# EAGLE design stm8l101_core (EAGLE 7.3.0)
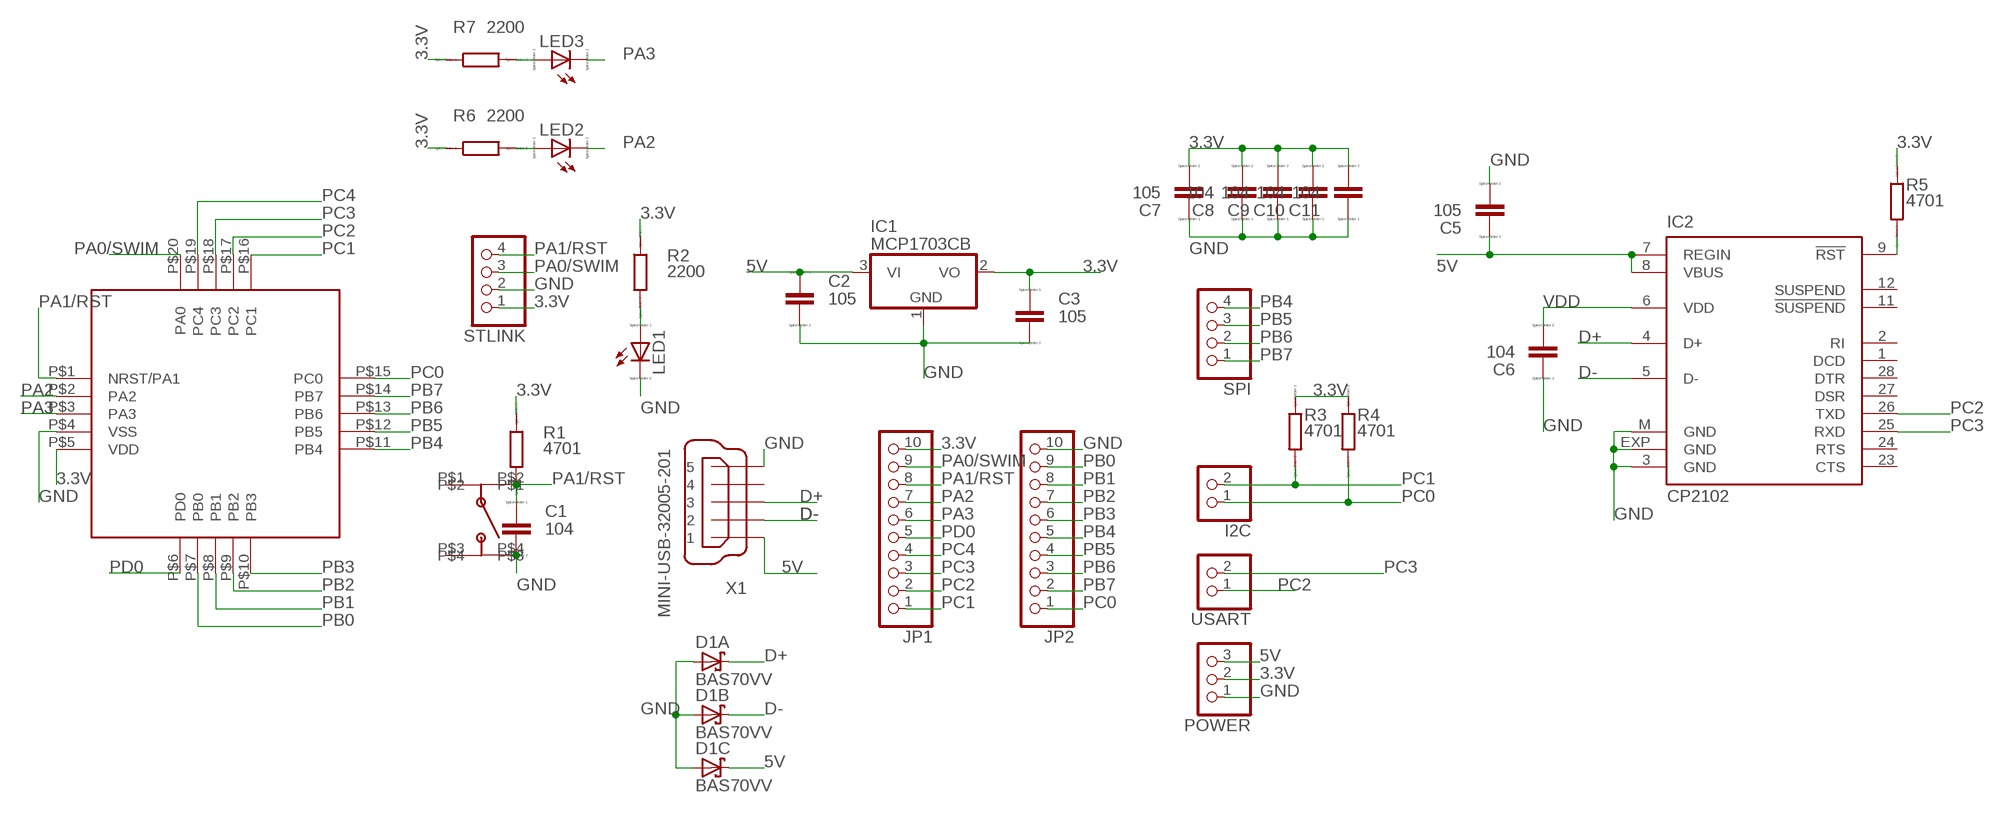
[diagram p0: schematic, sheet 1]

## Parts
C1  104  CC0603  [C0603]
C2  105  CC0603  [C0603]
C3  105  CC0603  [C0603]
C5  105  CC0603  [C0603]
C6  104  CC0603  [C0603]
C7  105  CC0603  [C0603]
C8  104  CC0603  [C0603]
C9  104  CC0603  [C0603]
C10  104  CC0603  [C0603]
C11  104  CC0603  [C0603]
D1  BAS70VV  [SOT666]
I2C  PINHD-1X2  [1X02]
IC1  MCP1703CB  [SOT23]
IC2  CP2102  [MLP28]
JP1  PINHD-1X10  [1X10]
JP2  PINHD-1X10  [1X10]
LED1  LED_ESML0603  [LED_SML0603]
LED2  LED_ESML0603  [LED_SML0603]
LED3  LED_ESML0603  [LED_SML0603]
POWER  PINHD-1X3  [1X03]
R1  4701  RR0603  [R0603]
R2  2200  RR0603  [R0603]
R3  4701  RR0603  [R0603]
R4  4701  RR0603  [R0603]
R5  4701  RR0603  [R0603]
R6  2200  RR0603  [R0603]
R7  2200  RR0603  [R0603]
SPI  PINHD-1X4  [1X04]
STLINK  PINHD-1X4  [1X04]
U$1  STM8L101  [UFQFPN20]
U$2  KFC-A05  [SWITCH-4X4]
USART  PINHD-1X2  [1X02]
X1  MINI-USB-32005-201  [32005-201]

## Nets
3.3V: C3.1 C7.2 C8.2 C9.2 C10.2 C11.2 IC1.2(VO) JP1.10 POWER.2 R1.1 R2.1 R3.1 R4.1 R5.1 R6.1 R7.1 STLINK.1 U$1.P$5(VDD)
5V: C2.1 C5.1 D1.4(C:C) IC1.3(VI) IC2.7(REGIN) IC2.8(VBUS) POWER.3 X1.1
D+: D1.6(A:C) IC2.4(D+) X1.3
D-: D1.5(B:C) IC2.5(D-) X1.2
GND: C1.2 C2.2 C3.2 C5.2 C6.1 C7.1 C8.1 C9.1 C10.1 C11.1 D1.1(A:A) D1.2(B:A) D1.3(C:A) IC1.1(GND) IC2.3(GND) IC2.EXP(GND) IC2.M(GND) JP2.10 LED1.C POWER.1 STLINK.2 U$1.P$4(VSS) U$2.P$4 X1.5
N$1: IC2.9(!RST) R5.2
N$2: LED1.A R2.2
N$3: LED2.A R6.2
N$5: LED3.A R7.2
PA0/SWIM: JP1.9 STLINK.3 U$1.P$20(PA0)
PA1/RST: C1.1 JP1.8 R1.2 STLINK.4 U$1.P$1(NRST/PA1) U$2.P$2
PA2: JP1.7 LED2.C U$1.P$2(PA2)
PA3: JP1.6 LED3.C U$1.P$3(PA3)
PB0: JP2.9 U$1.P$7(PB0)
PB1: JP2.8 U$1.P$8(PB1)
PB2: JP2.7 U$1.P$9(PB2)
PB3: JP2.6 U$1.P$10(PB3)
PB4: JP2.5 SPI.4 U$1.P$11(PB4)
PB5: JP2.4 SPI.3 U$1.P$12(PB5)
PB6: JP2.3 SPI.2 U$1.P$13(PB6)
PB7: JP2.2 SPI.1 U$1.P$14(PB7)
PC0: I2C.1 JP2.1 R4.2 U$1.P$15(PC0)
PC1: I2C.2 JP1.1 R3.2 U$1.P$16(PC1)
PC2: IC2.26(TXD) JP1.2 U$1.P$17(PC2) USART.1
PC3: IC2.25(RXD) JP1.3 U$1.P$18(PC3) USART.2
PC4: JP1.4 U$1.P$19(PC4)
PD0: JP1.5 U$1.P$6(PD0)
VDD: C6.2 IC2.6(VDD)
Unconnected: IC2.1(DCD) IC2.2(RI) IC2.11(!SUSPEND) IC2.12(SUSPEND) IC2.23(CTS) IC2.24(RTS) IC2.27(DSR) IC2.28(DTR) U$2.P$1 U$2.P$3 X1.4

## Library data of the parts
C1-C3 C5-C11 = eagle-ltspice:C: CAPACITOR, European symbol; SPICEMODEL: NONE; SPICEPREFIX: C
D1 = diode:BAS70VV: Silicon Schottky Diodes General-purpose diode for high-speed switching Source: BAS70_1PS7XSB70_SER_8.pdf
I2C USART = pinhead:PINHD-1X2: PIN HEADER
IC1 = linear:MCP1703: 250 mA, 16V, Low Quiescent Current LDO Regulator Source: http://ww1.microchip.com/downloads/en/DeviceDoc/22049b.pdf
IC2 = silabs:CP210*: Single-Chip USB to UART Bridge Source: www.silabs.com .. CP2101.pdf / cp2102.pdf; MF: FARNELL; MPN: CP2102-GM; OC_FARNELL: 9282130; OC_NEWARK: 30K5635
JP1 JP2 = pinhead:PINHD-1X10: PIN HEADER
LED1-LED3 = eagle-ltspice:LED_E: LED Source: http://www.osram.convergy.de Source: www.luxeon.com Source: www.kingbright.com; SPICEMODEL: NONE; SPICEPREFIX: D; SPICETYPE: diode
POWER = pinhead:PINHD-1X3: PIN HEADER
R1-R7 = eagle-ltspice:R: RESISTOR, European symbol; SPICEMODEL: NONE; SPICEPREFIX: R
SPI STLINK = pinhead:PINHD-1X4: PIN HEADER
U$1 = st-microelectronics:STM8L101; DEVICE: STM8F101
U$2 = switch:KFC-A05
X1 = con-cypressindustries:MINI-USB-: MINI USB-B Conector Source: www.cypressindustries.com; OC_FARNELL: unknown; OC_NEWARK: unknown

## Board
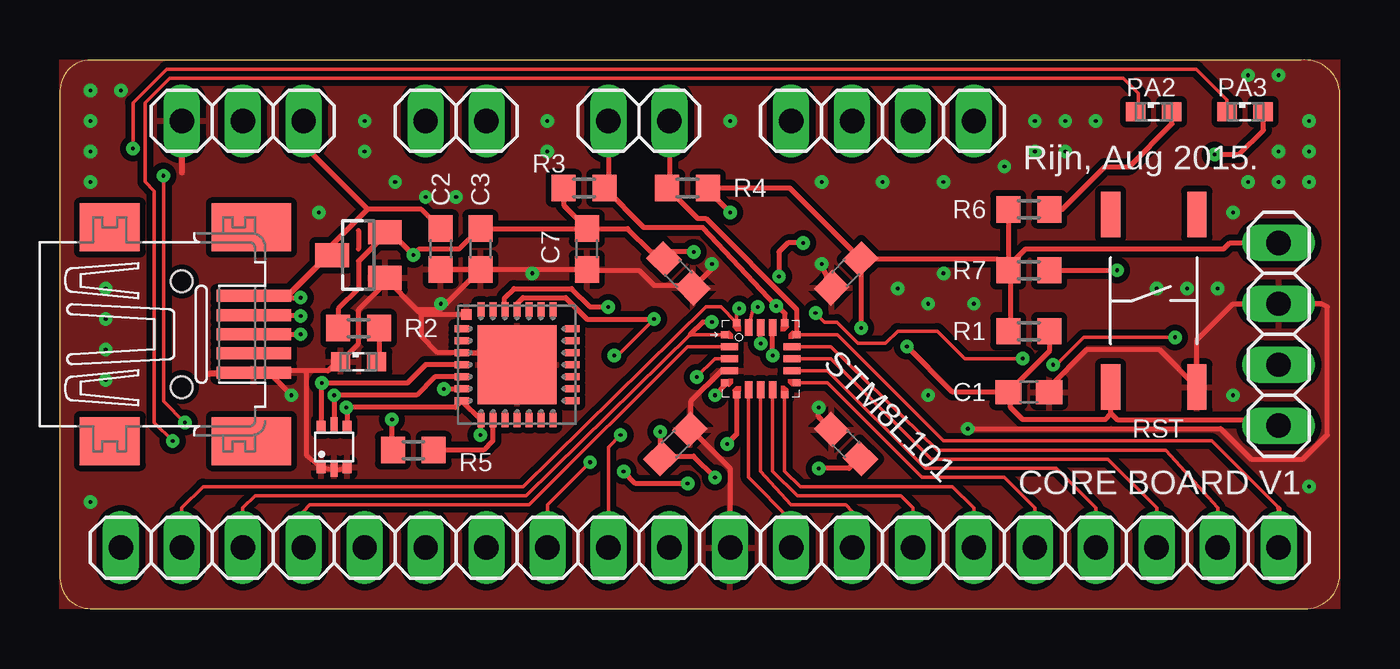
[diagram p1: board, top side]
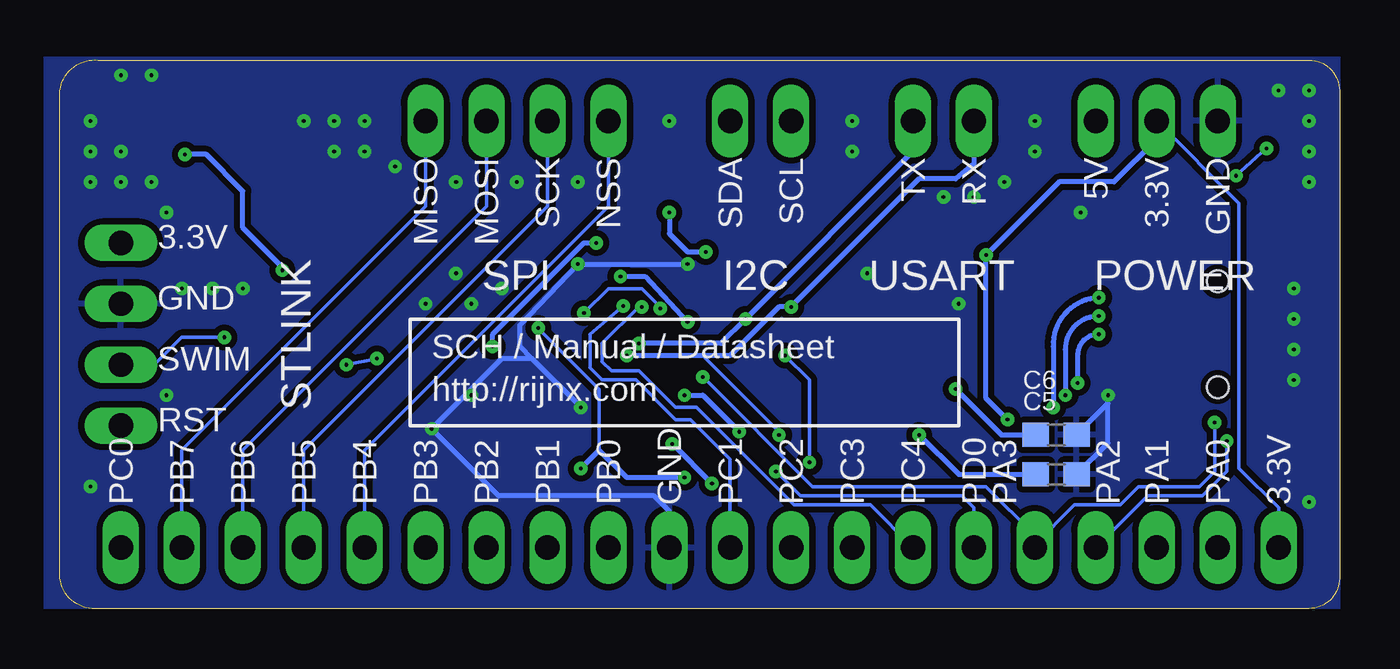
[diagram p2: board, bottom side, seen from below]

Size 53.34 x 22.87 mm. Coordinates in mm from the lower left corner, seen from the top.
Outline: 0,21.59 0,1.28 arc90 1.27,0.01 51.74,0.01 arc90 53.34,1.28 53.34,21.59 arc90 51.74,22.86 1.27,22.86 arc90 0,21.59
Copper layers (1*16): Top 0.035mm / dielectric 1.5mm / Bottom 0.035mm
Design rules "default *": minimum track width 5mil, minimum drill 6mil, track to track 0mil, track to pad 0mil, pad to pad 0mil, via to via 0mil, smd to smd 0mil, copper to edge 0mil, drill to drill 2mil, minimum pad ring 10mil, minimum via ring 8mil, stop-mask expansion 4mil, vias tented up to drill 0mil, thermal gap 10mil

### Footprints (pad centres in the part's own frame; a part is rotated, then mirrored left to right if it is on the bottom)
C0603 = smd 1.1 x 1: 1 -0.85,0; 2 0.85,0
SOT666 = smd 0.375 x 0.5: 1 -0.537,-0.85; 3 0.538,-0.85; 4 0.538,0.849; 6 -0.538,0.85 | smd 0.3 x 0.65: 2 0,-0.923; 5 0,0.925
1X02 = drill 1.016 long: 1 -1.27,0; 2 1.27,0
SOT23 = smd 1 x 1.4: 1 -0.95,-1.1; 2 0.95,-1.1; 3 0,1.1
MLP28 = smd 0.6 x 0.3: 1 -2.3,1.5; 2 -2.3,1; 3 -2.3,0.5; 4 -2.3,0; 5 -2.3,-0.5; 6 -2.3,-1; 7 -2.3,-1.5; 15 2.3,-1.5; 16 2.3,-1; 17 2.3,-0.5; 18 2.3,0; 19 2.3,0.5; 20 2.3,1; 21 2.3,1.5 | smd 0.3 x 0.6: 8 -1.5,-2.3; 9 -1,-2.3; 10 -0.5,-2.3; 11 0,-2.3; 12 0.5,-2.3; 13 1,-2.3; 14 1.5,-2.3; 22 1.5,2.3; 23 1,2.3; 24 0.5,2.3; 25 0,2.3; 26 -0.5,2.3; 27 -1,2.3; 28 -1.5,2.3 | smd 3.3 x 3.3: EXP 0,0 | smd 0.435 x 0.435: M -2.103,2.103
1X10 = drill 1.016 long: 1 -11.43,0; 2 -8.89,0; 3 -6.35,0; 4 -3.81,0; 5 -1.27,0; 6 1.27,0; 7 3.81,0; 8 6.35,0; 9 8.89,0; 10 11.43,0
LED_SML0603 = smd 0.8 x 0.8: A 0.75,0; C -0.75,0
1X03 = drill 1.016 long: 1 -2.54,0; 2 0,0; 3 2.54,0
R0603 = smd 1 x 1.1: 1 -0.85,0; 2 0.85,0
1X04 = drill 1.016 long: 1 -3.81,0; 2 -1.27,0; 3 1.27,0; 4 3.81,0
UFQFPN20 = smd 0.3 x 0.3: P$1 -1.5,1; P$5 -1.5,-1; P$6 -1,-1.5; P$10 1,-1.5; P$11 1.5,-1; P$15 1.5,1; P$16 1,1.5; P$20 -1,1.5 | smd 0.7 x 0.3: P$2 -1.3,0.5; P$3 -1.3,0; P$4 -1.3,-0.5; P$12 1.3,-0.5; P$13 1.3,0; P$14 1.3,0.5 | smd 0.3 x 0.7: P$7 -0.5,-1.3; P$8 0,-1.3; P$9 0.5,-1.3; P$17 0.5,1.3; P$18 0,1.3; P$19 -0.5,1.3
SWITCH-4X4 = smd 1.9 x 0.8: P$1 -3.6,-1.8; P$2 3.6,-1.8; P$3 -3.6,1.8; P$4 3.6,1.8
32005-201 = smd 3.1 x 0.5: 1 3,1.6; 2 3,0.8; 3 3,0; 4 3,-0.8; 5 3,-1.6 | smd 2.5 x 2: M1 -3,-4.45; M2 -3,4.45 | smd 3.3 x 2: M3 2.9,4.45; M4 2.9,-4.45 | hole 0.9: 0,2.2; 0,-2.2

### Placement (x,y rotation side)
C1  40.39,9.03 0 top
C2  15.88,15 270 top
C3  17.53,15 270 top
C5  11.81,5.6 0 bottom
C6  11.81,7.25 180 bottom
C7  21.97,15 90 top
C8  32.77,13.98 45 top
C9  32.77,6.87 315 top
C10  25.78,13.98 135 top
C11  25.65,6.87 225 top
D1  11.43,6.74 0 top
I2C  24.13,20.33 180 top
IC1  12.45,14.74 90 top
IC2  19.05,10.17 0 top
JP1  13.97,2.55 180 top
JP2  39.37,2.55 180 top
LED1  12.45,10.3 0 top
LED2  45.59,20.71 0 top
LED3  49.4,20.71 0 top
POWER  7.62,20.33 0 top
R1  40.39,11.57 0 top
R2  12.45,11.69 0 top
R3  21.84,17.54 0 top
R4  26.16,17.54 180 top
R5  14.73,6.61 0 top
R6  40.39,16.65 0 top
R7  40.39,14.11 0 top
SPI  34.29,20.33 180 top
STLINK  50.8,11.44 270 top
U$1  29.21,10.42 0 top
U$2  45.59,12.84 270 top
USART  16.51,20.33 0 top
X1  5.08,11.44 0 top

### Tracks (layer width: path | path; a pad name or v marks a point on that pad's centre or on a via)
3.3V  (via drill 0.15)
  Top 0.203: 11.56,11.69 R2.1 11.6,12.49 12.45,13.34 12.45,14.49 13.46,15.5 13.46,15.61 IC1.2 13.78,15.69 v14.73,14.74 14.99,15 16.64,15 17.49,15.85 C3.1 C7.2 | R5.1 13.84,6.65 v13.84,7.88 | C7.2 23.66,15.85 24.64,14.87 24.89,14.87 C10.2 25.47,14.87 v26.42,14.87 | R3.1 20.99,16.82 C7.2 | C8.2 30.41,17.54 R4.1 27.01,17.45 v27.94,16.52 | C8.2 39.06,14.58 R7.1 | R6.1 R7.1 | R7.1 39.62,14.11 | 39.62,14.11 39.62,11.65 R1.1 | U$1.P$5 27.71,9.3 v27.3,8.9 | v25.02,7.38 25.02,6.36 | 25.02,6.36 25.02,6.3 C11.2 | C9.2 33.31,6.27 32.89,5.85 v31.62,5.85 | v33.4,11.69 33.4,14.55 C8.2 | 25.02,6.36 26.42,6.36 v27.3,5.47 | 39.62,14.11 39.62,14.36 40.26,15 48.51,15 48.77,15.25 STLINK.1
  Bottom 0.152: JP1.10 2.54,4.2 4.19,5.85 4.19,16.9 POWER.2 | v33.4,11.69 30.86,9.15 30.86,6.61
  Bottom 0.203: v13.84,7.88 14.73,8.77 v14.73,14.74 11.68,17.79 9.4,17.79 7.62,19.57 POWER.2 | v27.3,8.9 26.54,8.9 v25.02,7.38 | v31.62,5.85 30.86,6.61 29.72,5.47 v27.3,5.47 | v27.94,16.52 27.94,15.63 27.18,14.87 v26.42,14.87
5V  (via drill 0.15)
  Top 0.203: X1.1 arc90 8.16,12.96 9.4,12.96 v10.03,12.96 | D1.4 11.97,8.36 arc90 v11.94,8.39 16.47,8.39 IC2.7 IC2.8 17.53,7.85 v17.53,7.25 | C2.1 15.07,16.65 12.83,16.65 | 12.83,16.65 11.35,15.17 IC1.3 | POWER.3 10.16,19.31 12.83,16.65
  Top 0.254: IC1.3 11.18,14.74 9.4,12.96
  Bottom 0.203: v10.03,12.96 arc-90 11.94,10.93 v11.94,8.39 | v17.53,7.25 15.88,5.6 C5.1
D+  (via drill 0.15)
  Top 0.203: X1.3 v10.03,11.44 | D1.6 10.89,9.38 arc-90 v10.92,9.41 14.48,9.41 15.24,10.17 IC2.4
  Bottom 0.203: v10.03,11.44 arc-90 10.92,10.55 v10.92,9.41
D-  (via drill 0.15)
  Top 0.203: X1.2 9.99,12.24 arc-90 v10.03,12.2 | D1.5 v11.43,8.9 14.86,8.9 15.62,9.66 IC2.5
  Bottom 0.203: v10.03,12.2 arc-90 11.43,10.8 v11.43,8.9
GND  (via drill 0.15)
  Top 0.203: 10.29,9.92 11.18,9.92 11.43,10.17 LED1.C 12.45,11.05 12.45,12.46 13.55,13.56 IC1.1 14.87,12.47 | 10.29,9.92 8.16,9.92 X1.5 8.71,9.84 v9.65,8.9 | D1.3 11.5,5.76 D1.2 11.36,5.76 D1.1 10.29,6.37 10.29,9.92 | 14.87,12.47 15.07,12.27 | 15.07,12.27 IC2.M | 15.07,12.27 15.07,11.36 15.75,10.68 IC2.3 18.67,10.68 19.05,10.3 IC2.EXP | C2.2 C3.2 | C3.2 15.85,12.47 14.87,12.47 | C10.1 26.29,13.47 24.77,13.47 24.13,14.11 21.97,14.11 C7.1 C3.2 | C1.2 41.24,9.24 42.8,10.8 45.83,10.8 U$2.P$4 47.39,11.21 48.9,12.71 STLINK.2 52.58,12.71 52.83,12.58 52.83,7.25 51.82,6.23 49.66,6.23 48.39,7.5 v37.85,7.5 | U$1.P$4 27.57,9.92 26.29,8.65 26.29,7.5 | 26.29,7.5 C11.1 | 26.29,7.5 27.94,5.85 JP2.10 | C9.1 | C9.1 31.62,8.01 v31.62,8.39 | C8.1 32.16,13.44 v31.75,14.36 | v27.18,14.36 27.18,14.17 C10.1 | C10.1 26.38,13.18 26.29,13.09
  Top 0.254: POWER.1 5.08,18.17 | 8.13,9.79 6.22,9.79
  Bottom 0.203: C6.1 9.65,8.56 v9.65,8.9 9.65,6.91 C5.2 | v31.62,8.39 33.66,10.42 | 33.66,10.42 34.92,10.42 v37.85,7.5 35.05,4.71 28.57,4.71 27.94,4.07 JP2.10 | v27.18,14.36 v31.75,14.36 34.16,11.82 34.16,10.93 33.66,10.42
  other vias: 1.27,21.6 2.54,21.6 1.27,20.33 1.27,19.06 1.27,17.79 10.79,16.52 1.91,13.34 1.91,12.07 1.91,10.8 1.91,9.53 1.27,4.45 12.7,20.33 12.7,19.06 13.97,17.79 15.24,17.15 16.51,17.15 20.32,19.06 20.32,20.33 27.94,20.33 31.75,17.79 34.29,17.79 36.83,17.79 39.37,18.42 40.64,20.33 40.64,19.06 41.91,20.33 41.91,19.06 43.18,20.33 50.8,19.06 49.53,22.23 50.8,22.23 52.07,20.33 52.07,19.06 52.07,17.79 50.8,17.79 49.53,17.79 48.9,16.52 45.72,13.34 46.99,13.34 48.26,13.34 48.9,8.9 52.07,5.09 36.2,8.9 36.83,13.98 38.1,12.71 36.2,12.71 34.92,13.34 19.68,13.98 15.88,12.71
  pour Top (isolate 0.254): 0,22.87 53.34,22.87 53.34,0.01 0,0.01
  pour Bottom (isolate 0.254): 0,23.01 0,0.01 54,0.01 54,23.01
N$1
  Top 0.203: IC2.9 18.03,7.85 18.03,6.99 17.65,6.61 R5.2
N$2
  Top 0.203: R2.2 13.3,10.27 LED1.A
N$3
  Top 0.203: R6.2 41.78,16.65 43.56,18.42 44.58,18.42 46.35,20.2 46.35,20.7 LED2.A
N$4
  Top 0.203: 12.45,15.76 12.45,15
N$5  (via drill 0.15)
  Top 0.203: R7.2 v44.07,14.11 | v48.13,18.93 49.15,18.93 50.16,19.95 50.16,20.7 LED3.A
  Bottom 0.203: v44.07,14.11 44.07,14.23 45.72,15.88 45.72,17.41 47.24,18.93 v48.13,18.93
PA0/SWIM  (via drill 0.15)
  Top 0.152: JP1.9 5.08,4.2 5.97,5.09 19.3,5.09 26.92,12.58 27.55,12.58 U$1.P$20 28.21,12.34 v28.32,12.51 | v31.5,12.33 31.88,11.95 32.38,11.95 33.27,11.06 34.42,11.06 34.92,11.57 36.58,11.57 37.72,10.42 v40.13,10.42 | v41.4,10.17 41.66,10.3 42.67,11.31 v46.48,11.31
  Bottom 0.152: v28.32,12.51 28.32,12.58 29.08,13.34 30.48,13.34 v31.5,12.33 | v40.13,10.42 v41.4,10.17 | v46.48,11.31 48.26,11.31 49.4,10.17 STLINK.3
PA1/RST  (via drill 0.15)
  Top 0.152: U$1.P$1 26.27,11.42 19.43,4.71 8.13,4.71 7.62,4.2 JP1.8
  Top 0.203: R1.2 41.24,10.73 C1.1 | U$2.P$2 43.79,8.16 43.81,8.14 | 43.81,8.14 43.56,7.88 40.13,7.88 39.62,8.39 39.62,8.94 C1.1 | 43.81,8.14 44.07,7.88 50.19,7.88 arc-45 STLINK.4 | C1.1 37.21,9.03 v35.31,10.93 | v30.99,15.25 30.35,15.25 29.97,14.87 v29.97,13.85 | v27.18,11.95 26.8,11.95 26.27,11.42
  Bottom 0.203: v35.31,10.93 35.31,11.44 31.5,15.25 v30.99,15.25 | v29.97,13.85 28.96,13.85 v27.18,11.95
PA2  (via drill 0.15)
  Top 0.152: U$1.P$2 26.15,10.92 19.56,4.33 10.41,4.33 10.16,4.07 JP1.7 | LED2.C 44.7,20.58 44.96,20.58 44.96,21.47 44.32,22.11 4.57,22.11 3.56,21.09 3.56,17.79 3.94,17.41 3.94,7.76 v4.7,6.99
  Bottom 0.152: v4.7,6.99 4.7,5.72 5.71,4.71 8,4.71 10.03,2.68 10.16,2.68 JP1.7
PA3  (via drill 0.15)
  Top 0.152: v26.54,9.66 27.3,10.42 U$1.P$3 | LED3.C 48.65,20.83 48.64,20.84 48.64,21.22 47.37,22.49 4.45,22.49 3.05,21.09 v3.05,19.19 | v4.32,18.04 4.32,8.65 v5.21,7.76
  Bottom 0.152: v26.54,9.66 21.97,5.09 14.73,5.09 12.7,3.06 JP1.6 12.7,2.68 11.05,4.33 9.14,4.33 8.38,5.09 5.84,5.09 5.21,5.72 v5.21,7.76 | v3.05,19.19 v4.32,18.04
PB0
  Top 0.152: JP2.9 30.48,3.69 28.7,5.47 U$1.P$7
PB1
  Top 0.152: U$1.P$8 29.21,5.72 30.48,4.33 32.77,4.33 33.02,4.07 JP2.8
PB2
  Top 0.152: U$1.P$9 29.71,5.73 30.73,4.71 35.05,4.71 35.56,4.2 JP2.7
PB3
  Top 0.152: U$1.P$10 30.21,5.74 30.86,5.09 37.21,5.09 38.1,4.2 JP2.6
PB4
  Top 0.152: U$1.P$11 31.99,9.42 35.94,5.47 39.37,5.47 40.64,4.2 JP2.5
  Bottom 0.152: SPI.4 30.48,16.77 40.64,6.61 JP2.5
PB5
  Top 0.152: U$1.P$12 32,9.92 36.07,5.85 41.53,5.85 43.18,4.2 JP2.4
  Bottom 0.152: SPI.3 33.02,16.77 43.18,6.61 JP2.4
PB6
  Top 0.152: U$1.P$13 32.13,10.42 36.32,6.23 43.69,6.23 45.72,4.2 JP2.3
  Bottom 0.152: SPI.2 35.56,16.77 45.72,6.61 JP2.3
PB7
  Top 0.152: U$1.P$14 32.14,10.92 36.58,6.61 46.1,6.61 48.26,4.2 JP2.2
  Bottom 0.152: SPI.1 38.1,16.77 48.26,6.61 JP2.2
PC0
  Top 0.152: U$1.P$15 32.4,11.42 36.83,6.99 48.01,6.99 50.8,4.2
  Top 0.203: U$1.P$15 30.71,12.48 26.92,16.27 26.58,16.27 R4.2 25.4,17.57 I2C.1 | 50.8,4.2 JP2.1
PC1  (via drill 0.15)
  Top 0.203: U$1.P$16 30.23,11.94 30.23,12.3 29.9,12.61 v29.86,12.62 26.8,15.88 24.34,15.88 R3.2 22.86,17.5 I2C.2
  Bottom 0.152: JP1.1 25.4,6.23 27.05,7.88 27.69,7.88 29.34,9.53 30.73,9.53 31.24,10.04 31.24,11.44 v29.86,12.62
PC2  (via drill 0.15)
  Top 0.152: JP1.2 22.86,6.74 v23.37,7.25
  Top 0.203: IC2.26 18.54,12.96 18.92,13.34 21.34,13.34 22.1,12.58 v22.86,12.58 | v29.72,10.55 29.71,10.69 U$1.P$17
  Bottom 0.152: v23.37,7.25 23.37,7.38 26.54,10.55
  Bottom 0.203: v29.72,10.55 26.54,10.55 25.4,10.55 23.37,12.58 v22.86,12.58 17.53,17.92 16,17.92 15.24,18.55 USART.1
PC3  (via drill 0.15)
  Top 0.152: JP1.3 20.32,4.33 v22.1,6.11 | v23.11,10.55 23.24,10.55 v24.77,12.07
  Top 0.203: IC2.25 19.05,12.71 19.3,12.96 21.08,12.96 21.97,12.07 v24.77,12.07 | v29.21,11.06 U$1.P$18
  Bottom 0.152: v22.1,6.11 22.1,9.53 v23.11,10.55
  Bottom 0.203: v29.21,11.06 25.78,11.06 v24.77,12.07 17.78,19.06 USART.2
PC4  (via drill 0.15)
  Top 0.152: v29.08,12.58 28.89,12.47 U$1.P$19
  Bottom 0.152: JP1.4 19.56,4.33 22.73,4.33 26.8,8.39 27.69,8.39 29.21,9.92 30.35,9.92 30.73,10.3 30.73,11.06 29.21,12.58 v29.08,12.58
PD0  (via drill 0.15)
  Top 0.203: U$1.P$6 28.21,7.26 v27.81,6.87 | v26.16,5.22 24,5.22 v23.5,5.72
  Bottom 0.152: v23.5,5.72 22.48,4.71 15.75,4.71 15.24,4.2 JP1.5
  Bottom 0.203: v27.81,6.87 v26.16,5.22
VDD  (via drill 0.15)
  Top 0.203: IC2.6 16.73,9.15 v16,9.15
  Bottom 0.203: v16,9.15 14.1,7.25 C6.2

### Text on the board
tNames: PA2 | PA3 | Rijn, Aug 2015. | STM8L101 | RST | CORE BOARD V1
bNames: GND | 3.3V | 5V | RX | TX | SCL | SDA | NSS | SCK | MOSI | MISO | 3.3V | GND | SCH / Manual / Datasheet | SWIM | http://rijnx.com | RST | 3.3V | PA0 | PA1 | PA2 | PA3 | PD0 | PC4 | PC3 | PC2 | PC1 | GND | PB0 | PB1 | PB2 | PB3 | PB4 | PB5 | PB6 | PB7 | PC0